# EAGLE design Adafruit Ultimate GPS Hat (EAGLE 9.1.3)
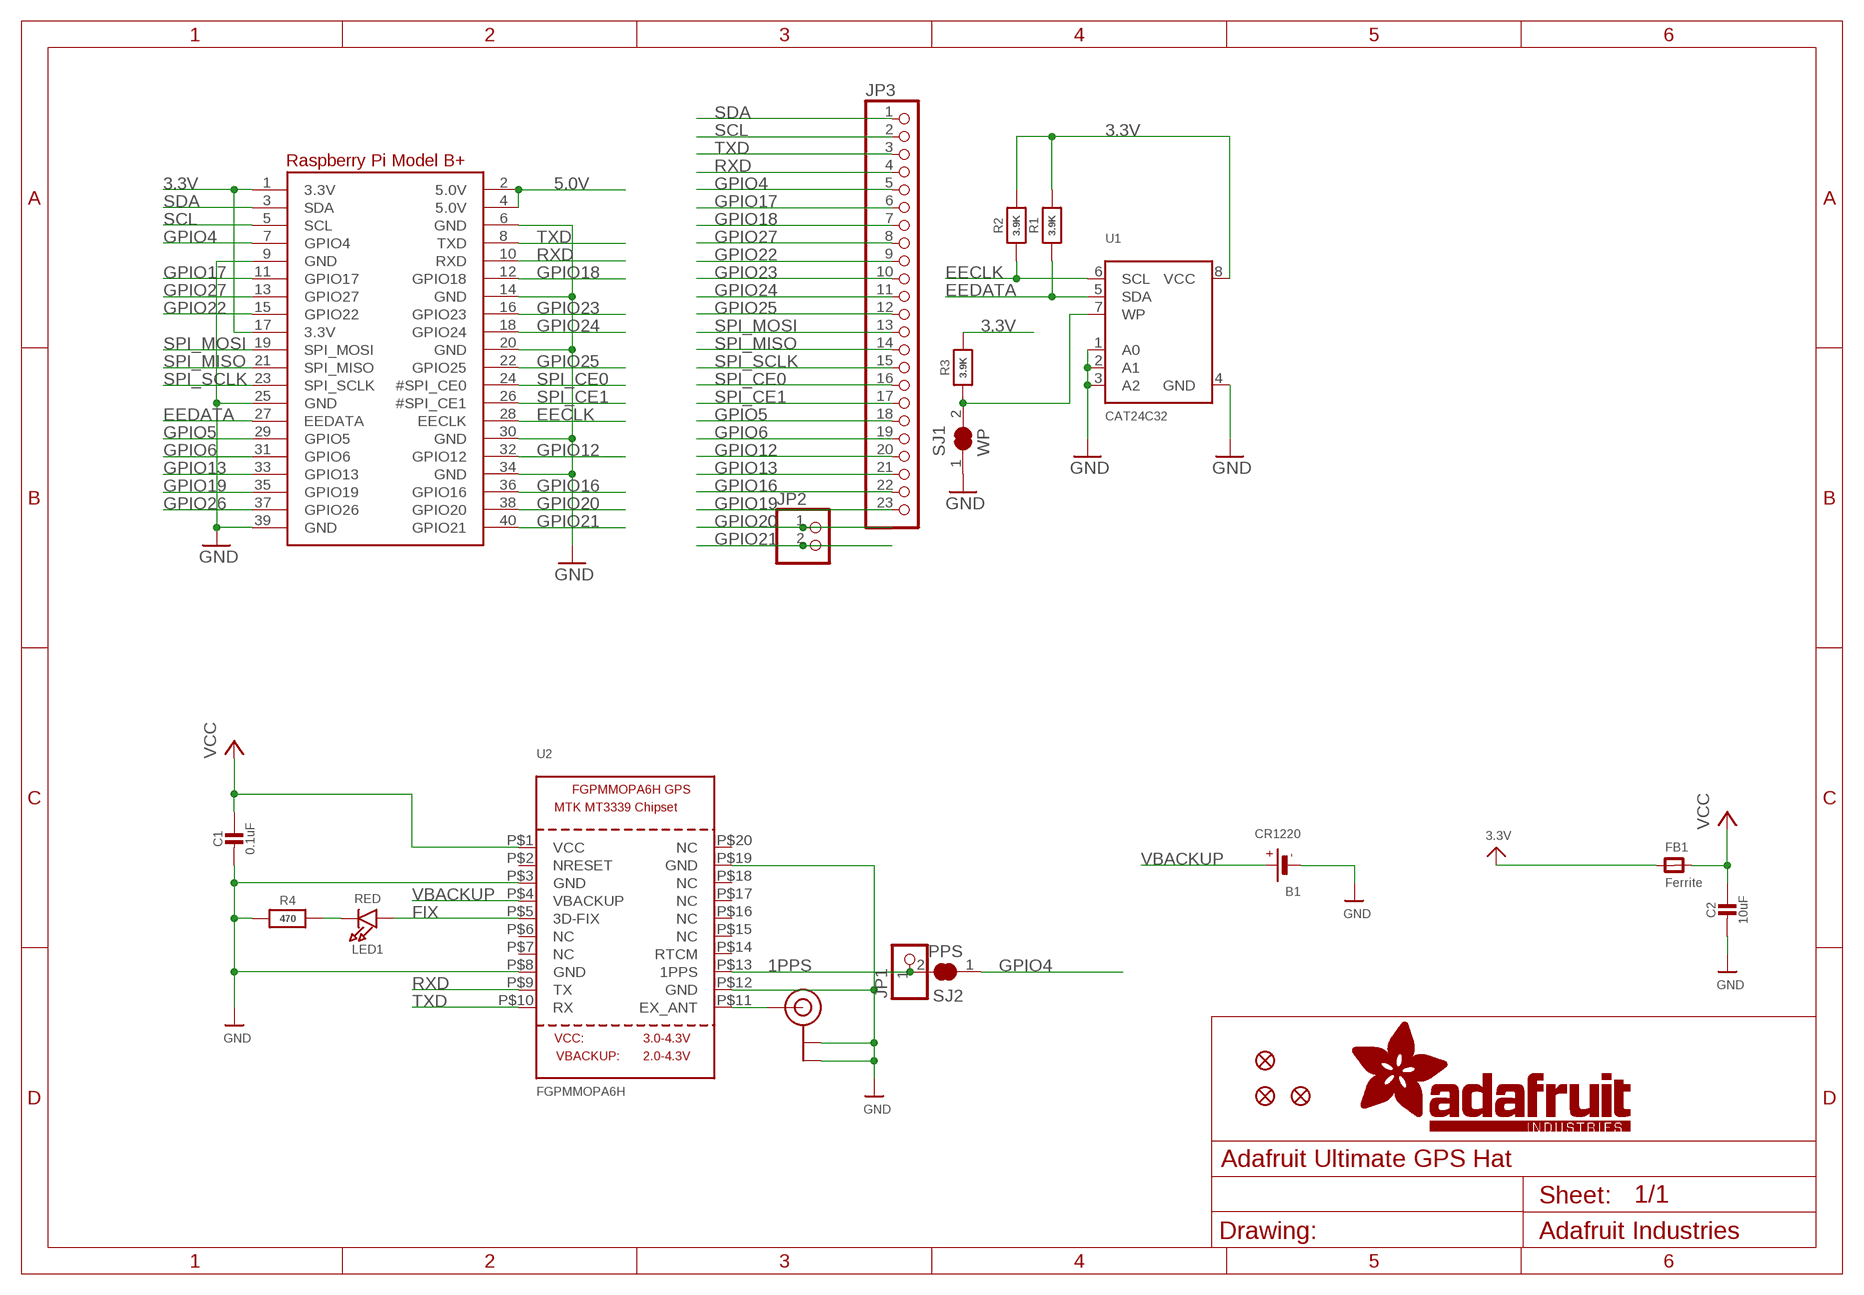
[diagram p0: schematic, sheet 1]

## Parts
B1  CR1220  BATTERYCR1220_SMT  [CR1220]
C1  0.1uF  CAP_CERAMIC0805-NOOUTLINE  [0805-NO]
C2  10uF  CAP_CERAMIC0805-NOOUTLINE  [0805-NO]
FB1  Ferrite  FERRITE0805  [0805]
FID1  FIDUCIAL_1MM  [FIDUCIAL_1MM]
FID2  FIDUCIAL_1MM  [FIDUCIAL_1MM]
FID3  FIDUCIAL_1MM  [FIDUCIAL_1MM]
JP1  PINHD-1X1CB  [1X01-CLEANBIG]
JP2  HEADER-1X2ROUND  [1X02_ROUND]
JP3  HEADER-1X23  [1X23_ROUND_70MIL]
LED1  RED  LED0805  [CHIPLED_0805]
R1  3.9K  RESISTOR0805_NOOUTLINE  [0805-NO]
R2  3.9K  RESISTOR0805_NOOUTLINE  [0805-NO]
R3  3.9K  RESISTOR0805_NOOUTLINE  [0805-NO]
R4  470  RESISTOR0805_NOOUTLINE  [0805-NO]
RPI1  RASPBERRYPI_BPLUS_HATSLOTS  [PI_HAT_SLOTS]
SJ1  WP  SOLDERJUMPER_CLOSED  [SOLDERJUMPER_CLOSEDWIRE]
SJ2  PPS  SOLDERJUMPER_CLOSED  [SOLDERJUMPER_CLOSEDWIRE]
U1  CAT24C32  EEPROM_I2C_SOIC8_GENERIC  [SOIC8_150MIL]
U2  FGPMMOPA6H  GPS_FGPMMOPA6H  [FGPMMOPA6H]
U$20  U.FL  [U.FL]

## Nets
1PPS: JP1.1 SJ2.2 U2.P$13(1PPS)
3.3V: FB1.1 R1.2 R2.2 R3.2 RPI1.1(3.3V) RPI1.17(3.3V) U1.8(VCC)
5.0V: RPI1.2(5.0V) RPI1.4(5.0V)
EECLK: R2.1 RPI1.28(EECLK) U1.6(SCL)
EEDATA: R1.1 RPI1.27(EEDATA) U1.5(SDA)
FIX: LED1.A U2.P$5(3D-FIX)
GND: B1.- C1.2 C2.2 R4.1 RPI1.6(GND) RPI1.9(GND) RPI1.14(GND) RPI1.20(GND) RPI1.25(GND) RPI1.30(GND) RPI1.34(GND) RPI1.39(GND) SJ1.1 U1.1(A0) U1.2(A1) U1.3(A2) U1.4(GND) U2.P$3(GND) U2.P$8(GND) U2.P$12(GND) U2.P$19(GND) U$20.P$1(GND) U$20.P$2(GND)
GPIO4: JP3.5 RPI1.7(GPIO4) SJ2.1
GPIO5: JP3.18 RPI1.29(GPIO5)
GPIO6: JP3.19 RPI1.31(GPIO6)
GPIO12: JP3.20 RPI1.32(GPIO12)
GPIO13: JP3.21 RPI1.33(GPIO13)
GPIO16: JP3.22 RPI1.36(GPIO16)
GPIO17: JP3.6 RPI1.11(GPIO17)
GPIO18: JP3.7 RPI1.12(GPIO18)
GPIO19: JP3.23 RPI1.35(GPIO19)
GPIO20: JP2.1 RPI1.38(GPIO20)
GPIO21: JP2.2 RPI1.40(GPIO21)
GPIO22: JP3.9 RPI1.15(GPIO22)
GPIO23: JP3.10 RPI1.16(GPIO23)
GPIO24: JP3.11 RPI1.18(GPIO24)
GPIO25: JP3.12 RPI1.22(GPIO25)
GPIO26: RPI1.37(GPIO26)
GPIO27: JP3.8 RPI1.13(GPIO27)
N$16: R3.1 SJ1.2 U1.7(WP)
N$24: LED1.C R4.2
N$26: U2.P$11(EX_ANT) U$20.P$3(SIGNAL)
RXD: JP3.4 RPI1.10(RXD) U2.P$9(TX)
SCL: JP3.2 RPI1.5(SCL)
SDA: JP3.1 RPI1.3(SDA)
SPI_CE0: JP3.16 RPI1.24(#SPI_CE0)
SPI_CE1: JP3.17 RPI1.26(#SPI_CE1)
SPI_MISO: JP3.14 RPI1.21(SPI_MISO)
SPI_MOSI: JP3.13 RPI1.19(SPI_MOSI)
SPI_SCLK: JP3.15 RPI1.23(SPI_SCLK)
TXD: JP3.3 RPI1.8(TXD) U2.P$10(RX)
VBACKUP: B1.+$1(+) B1.+$2(+) U2.P$4(VBACKUP)
VCC: C1.1 C2.1 FB1.2 U2.P$1(VCC)
Unconnected: U2.P$2(NRESET) U2.P$6(NC) U2.P$7(NC) U2.P$14(RTCM) U2.P$15(NC) U2.P$16(NC) U2.P$17(NC) U2.P$18(NC) U2.P$20(NC)

## Library data of the parts
B1 = microbuilder:BATTERY: CR1220 SMT - Digikey: 3001K-ND CD2032 BAT-HLD-001 - Digikey: BAT-HLD-001-ND
C1 C2 = microbuilder:CAP_CERAMIC: Ceramic Capacitors For new designs, use the packages preceded by an '_' character since they are more reliable: The following footprints should be used on most boards: _0402 - Standard footprint for regular board layouts _0603 - Standard footprint for regular board layouts _0805 - Standard footprint for regular board layouts _1206 - Standard footprint for regular board layouts For extremely tight-pitch boards where space is at a premium, the following 'micro-pitch' footprints can be used (smaller pads, no silkscreen outline, etc.): _0402MP - Micro-pitch footprint for very dense/compact boards _0603MP - Micro-pitch footprint for very dense/compact boards _0805MP - Micro-pitch footprint for very dense/compact boards _1206MP - Micro-pitch footprint for very dense/compact boards
FB1 = microbuilder:FERRITE: Ferrite Bead 0603 MMZ1608B121C - 120 Ohm @ 100MHz, 600mA, 0.15 Ohm DC Resistance - Digikey: 445-2164-1-ND BK1608HW121-T - 120 Ohm, 600mA Ferrite Chip - Digikey: 587-1876-2-ND 0805 HZ0805B272R-10 - 2.7K Ohm @ 100MHz, 200mA, 0.8 Ohm DC Resistance - Digikey: 240-2504-1-ND (see also Murata BLM21BD272SN1L) MMZ2012Y152B - 1.5K Ohm @ 100MHz, 500mA, 0.4 Ohm DC Resistance - Digikey: 445-1560-1-ND - Mainly for high frequency (80-400MHz) MMZ2012R102A - 1K Ohm @ 100MHz, 500mA, 0.3 Ohm DC Resistance - Digikey: 445-1555-2-ND - More general purpose (10-200MHz)
FID1-FID3 = microbuilder:FIDUCIAL: Fiducial Alignment Points Various fiducial points for machine vision alignment.; BOM: EXCLUDE
JP1 = adafruit:PINHD-1X1: Pin header 1x1 for 0.1" spacing With round pins
JP2 = microbuilder:HEADER-1X2: PIN HEADER
JP3 = microbuilder:HEADER-1X23
LED1 = microbuilder:LED: LED 0603 - 0603 Surface Mount Package 2mA: Green LED - Low Power (3.9mcd, 2ma, 1.7Vf) - Digikey: 475-2709-2-ND Orange LED - Low Power (9.8mcd, 2ma, 1.8Vf) - Digikey: 475-1194-2-ND Red LED - Low Power (5mcd, 2ma, 1.8Vf) - Digikey: 475-1195-2-ND Yellow LED - Low Power (7mcd, 2ma, 1.8Vf) - Digikey: 475-1196-2-ND 5mA: Blue LED - Low Power (17mcd, 5ma, 2.9Vf) - Digikey: LNJ937W8CRACT-ND 0805 - 0805 Surface Mount Package 2mA: Red LED (8.8mcd, 2mA, 1.8Vf, Clear) - Low Power [Digikey: 475-2510-1-ND] Green LED (5mcd, 2mA, 1.8Vf, Clear) - Low Power [Digikey: 475-2730-1-ND] Yellow LED (11.3mcd, 2mA, 1.8Vf, Clear) - Low Power [Digikey: 475-2555-1-ND] 20mA: Red LED (104mcd, 20mA, Diffused) - LS R976 [Digikey: 475-1278-6-ND] Red LED (12mcd, 20mA, 2.0Vf, Clear) - APT2012EC [Digikey: 754-1128-1-ND] Green LED (15mcd, 20mA, 2.2Vf, Clear) - APT2012GC [Digikey: 754-1131-1-ND] Orange LED (160mcd, 20mA, 2.1Vf, Clear) - APT2012SECK [Digikey: 754-1130-1-ND] 1206 - 1206 Surface Mount Package Green LED (26mcd, 20mA, Diffused) - LG N971 [Digikey: 475-1407-6-ND] Red LED (15mcd, 20mA, Diffused) - LH N974 [Digikey: 475-1416-6-ND] Cree - Cree High-Power Surface Mount LEDs XPEBWT-L1-0000-00D50 - White 111lm 350mA 2.9Vf 6200K 110° XTEAWT-00-0000-00000LEE3 - White 114lm 350mA 2.85Vf 5000K 115° Everlight - Everlight 45-21 Series Surface Mount LEDs 45-21/QK2C-B2832AC2CB2/2T - Warm White 2000mcd 20mA 3.25Vf 3050K 120° 45-21/LK2C-B38452C4CB2/2T - Nuetral White 2000mcd 20mA 3.25Vf 4150K 120° 45-21/LK2C-B50634C6CB2/2T - Cold White 2200mcd 20mA 3.25Vf 5650K 120° PLCC2 Reverse Mount LS T77K-J1L2-1-0-2-R18-Z - Red 11.25mcd 2mA 1.8Vf 630nm 120° LO T77K-L1M2-24-Z - Orange 19.6mcd 2mA 1.8Vf 606nm 120° LY T77K-K2M1-26-Z - Yellow 15.7mcd 2mA 1.8Vf 587nm 120°
R1-R4 = microbuilder:RESISTOR: Resistors For new designs, use the packages preceded by an '_' character since they are more reliable: The following footprints should be used on most boards: _0402 - Standard footprint for regular board layouts _0603 - Standard footprint for regular board layouts _0805 - Standard footprint for regular board layouts _1206 - Standard footprint for regular board layouts For extremely tight-pitch boards where space is at a premium, the following 'micro-pitch' footprints can be used (smaller pads, no silkscreen outline, etc.): _0402MP - Micro-pitch footprint for very dense/compact boards _0603MP - Micro-pitch footprint for very dense/compact boards _0805MP - Micro-pitch footprint for very dense/compact boards _1206MP - Micro-pitch footprint for very dense/compact boards
RPI1 = microbuilder:RASPBERRYPI_BPLUS
SJ1 SJ2 = microbuilder:SOLDERJUMPER_CLOSED: Solder Jumper - Closed These solder jumpers are closed by default CLOSEDWIRE - 10 mil trace between pads that can be cut and resoldered later CLOSEDPERM - 63 mil trace between pads for a permanent connection (used to 'bridge' two signals, a shameless hack for Eagle). Can double as a test point as well (no cream layer)
U1 = microbuilder:EEPROM_I2C_SOIC8_GENERIC: Note: The same pinout is used for many I2C EEPROMs in SOIC8(150mil) from a variety of manufacturers and in various sizes. Examples: 16K (2K x 8 Bit) I2C EEPROM 1.7-5.5V, 400KHz, -40°C-85°C Digikey: CAT24C16WI-GT3CT-ND 256K (32K x 8 Bit) I2C EEPROM 1.7-5.5V, 400KHz, -40°C-85°C Digikey: 24AA256-I/SN-ND
U2 = microbuilder:GPS_FGPMMOPA6H: GPS Module - MTK MT3339 Chipset, -165dBm sensitivity, 22 channels, 10Hz, auto-select external antenna options
U$20 = microbuilder:U.FL: U.FL Antenna Connector

## Board
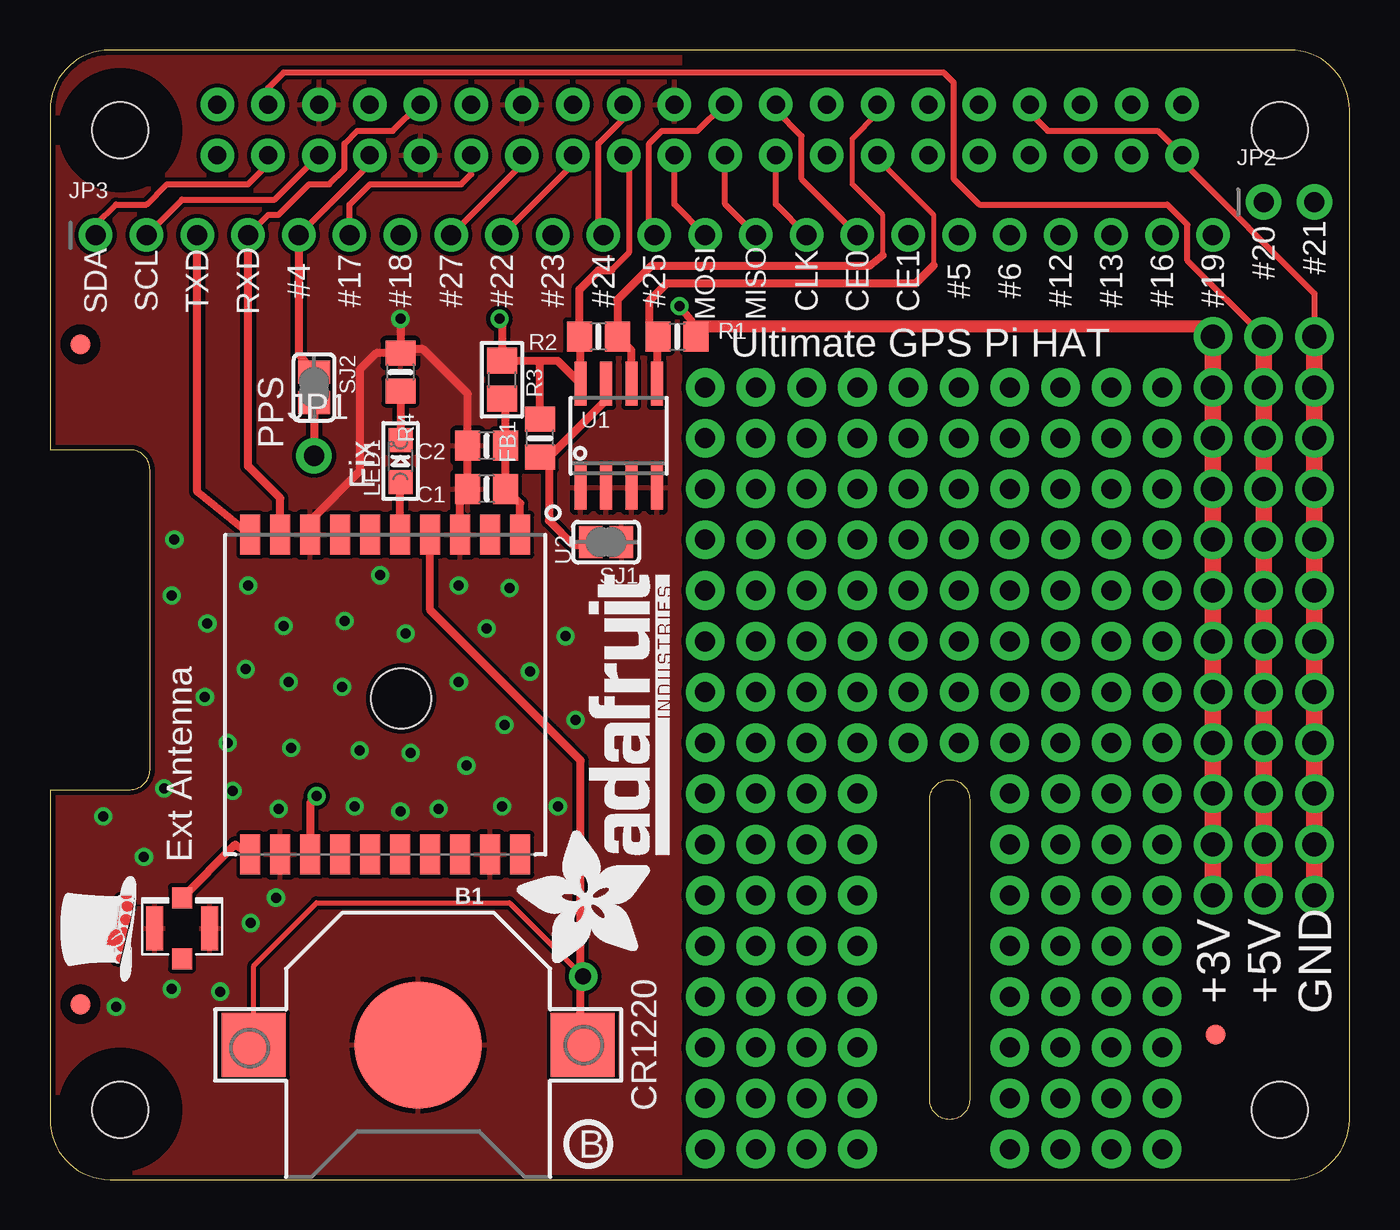
[diagram p1: board, top side]
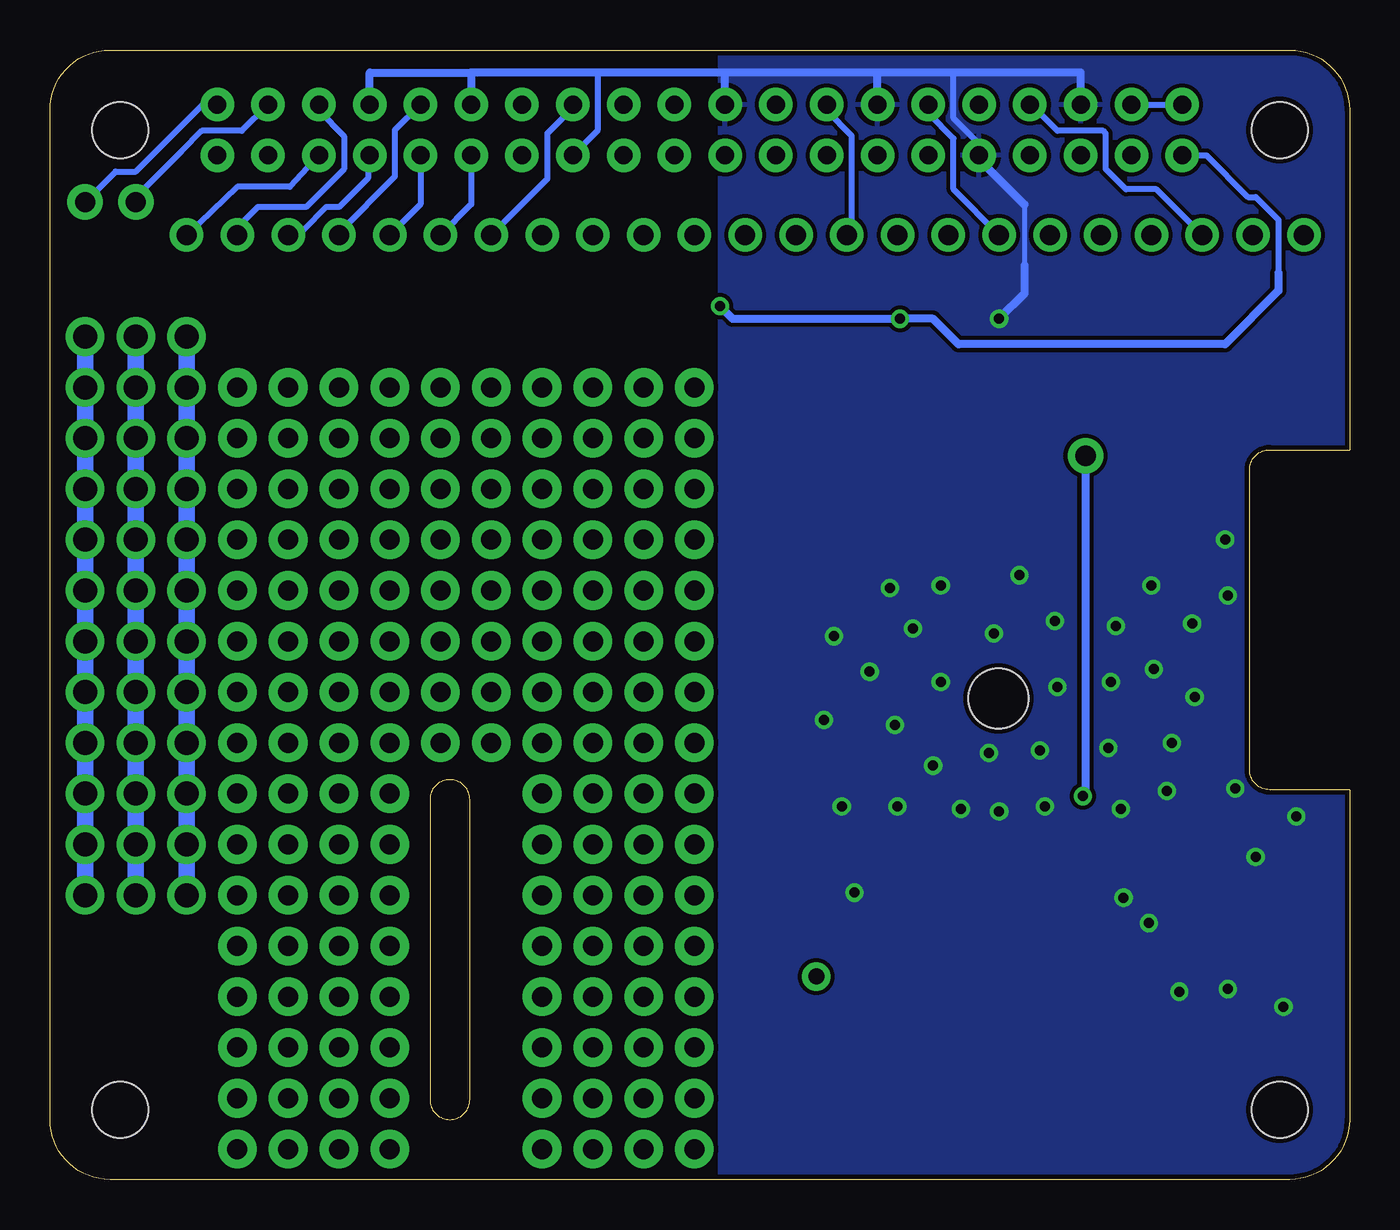
[diagram p2: board, bottom side, seen from below]

Size 65 x 56.5 mm. Coordinates in mm from the lower left corner, seen from the top.
Copper layers (1*16): Top 0.035mm / dielectric 1.5mm / Bottom 0.035mm
Design rules "adafruit": minimum track width 8mil, minimum drill 15.5mil, track to track 8mil, track to pad 8mil, pad to pad 8mil, via to via 8mil, smd to smd 8mil, copper to edge 10mil, drill to drill 8mil, minimum pad ring 10mil, minimum via ring 8mil, stop-mask expansion 2mil, vias tented up to drill 20mil, thermal gap 10mil

### Footprints (pad centres in the part's own frame; a part is rotated, then mirrored left to right if it is on the bottom)
CR1220 = smd 3.2 x 3.2: +$1 -8.225,0; +$2 8.225,0 | smd 6.35 x 6.35: - 0,0
0805-NO = smd 1.24 x 1.5: 1 -0.95,0; 2 0.95,0
0805 = smd 1.3 x 1.5: 1 -0.95,0; 2 0.95,0
FIDUCIAL_1MM = smd 1 x 1: 1 0,0
1X01-CLEANBIG = drill 1.016 pad 1.778: 1 0,0
1X02_ROUND = drill 1 pad 1.778: 1 -1.27,0; 2 1.27,0
1X23_ROUND_70MIL = drill 1 pad 1.676: 1 -27.94,0; 2 -25.4,0; 3 -22.86,0; 4 -20.32,0; 5 -17.78,0; 6 -15.24,0; 7 -12.7,0; 8 -10.16,0; 9 -7.62,0; 10 -5.08,0; 11 -2.54,0; 12 0,0; 13 2.54,0; 14 5.08,0; 15 7.62,0; 16 10.16,0; 17 12.7,0; 18 15.24,0; 19 17.78,0; 20 20.32,0; 21 22.86,0; 22 25.4,0; 23 27.94,0
CHIPLED_0805 = smd 1.2 x 1.2: A 0,-1.05; C 0,1.05
PI_HAT_SLOTS = drill 0.9 pad 1.676: 1 8.37,51.23; 2 8.37,53.77; 3 10.91,51.23; 4 10.91,53.77; 5 13.45,51.23; 6 13.45,53.77; 7 15.99,51.23; 8 15.99,53.77; 9 18.53,51.23; 10 18.53,53.77; 11 21.07,51.23; 12 21.07,53.77; 13 23.61,51.23; 14 23.61,53.77; 15 26.15,51.23; 16 26.15,53.77; 17 28.69,51.23; 18 28.69,53.77; 19 31.23,51.23; 20 31.23,53.77; 21 33.77,51.23; 22 33.77,53.77; 23 36.31,51.23; 24 36.31,53.77; 25 38.85,51.23; 26 38.85,53.77; 27 41.39,51.23; 28 41.39,53.77; 29 43.93,51.23; 30 43.93,53.77; 31 46.47,51.23; 32 46.47,53.77; 33 49.01,51.23; 34 49.01,53.77; 35 51.55,51.23; 36 51.55,53.77; 37 54.09,51.23; 38 54.09,53.77; 39 56.63,51.23; 40 56.63,53.77 | hole 2.8: 3.5,3.5; 3.5,52.5; 61.5,52.5; 61.5,3.5
SOLDERJUMPER_CLOSEDWIRE = smd 1.168 x 1.6: 1 -0.762,0; 2 0.762,0 | smd 0.635 x 0.203: WIRE 0,0
SOIC8_150MIL = smd 0.6 x 2.2: 1 -1.905,-2.6; 2 -0.635,-2.6; 3 0.635,-2.6; 4 1.905,-2.6; 5 1.905,2.6; 6 0.635,2.6; 7 -0.635,2.6; 8 -1.905,2.6
FGPMMOPA6H = smd 2 x 1: P$1 -8,6.75; P$2 -8,5.25; P$3 -8,3.75; P$4 -8,2.25; P$5 -8,0.75; P$6 -8,-0.75; P$7 -8,-2.25; P$8 -8,-3.75; P$9 -8,-5.25; P$10 -8,-6.75; P$11 8,-6.75; P$12 8,-5.25; P$13 8,-3.75; P$14 8,-2.25; P$15 8,-0.75; P$16 8,0.75; P$17 8,2.25; P$18 8,3.75; P$19 8,5.25; P$20 8,6.75 | hole 3: 0.2,0.8
U.FL = smd 2.2 x 0.85: P$1 0,1.375; P$2 0,-1.375 | smd 1.05 x 1: P$3 1.525,0; P$4 -1.525,0

### Placement (x,y rotation side)
B1  18.41,6.73 180 top
C1  21.84,34.54 180 top
C2  21.84,36.7 180 top
FB1  22.61,40.01 270 top
FID1  1.52,8.76 0 top
FID2  1.52,41.78 0 top
FID3  58.29,7.24 0 top
JP1  13.21,36.2 0 top
JP2  61.98,48.9 0 top
JP3  30.23,47.24 0 top
LED1  17.53,35.94 0 top
R1  31.37,42.16 0 top
R2  27.43,42.16 180 top
R3  24.51,37.08 90 top
R4  17.53,40.39 270 top
RPI1  0,0 0 top
SJ1  27.81,31.88 180 top
SJ2  13.21,39.62 270 top
U1  28.45,37.21 0 top
U2  16.76,24.26 270 top
U$3  [ADAFRUIT_TEXT_20MM]  30.99,10.67 90 top
U$4  [PIHATLOGO]  4.32,9.91 90 top
U$6  [PCBFEAT-REV-056]  26.92,1.78 0 top
U$20  6.6,12.57 90 top

### Tracks (layer width: path | path; a pad name or v marks a point on that pad's centre or on a via)
1PPS  (via drill 0.5)
  Top 0.406: SJ2.2 JP1.1 | v13.34,19.18 13.01,18.86 U2.P$13
  Bottom 0.406: JP1.1 13.21,19.3 v13.34,19.18
3.3V  (via drill 0.5, 1.2 pad 1.93)
  Top 0.305: RPI1.17 28.96,50.96 28.96,46.36 28.07,45.47
  Top 0.406: 24.64,40.95 FB1.1 22.61,42.93 v22.48,43.05 | 24.64,40.95 25.4,40.95 U1.8 26.54,42.23 R2.2 26.48,44.52 27.43,45.47 28.07,45.47 | R1.2 32.07,42.99 v31.5,43.69 | R3.2 24.51,40.83 24.64,40.95
  Top 0.61: v58.17,42.16 57.66,42.67 32,42.67 32.07,42.61 R1.2
  Top 0.813: v58.17,42.16 v58.17,14.22
  Bottom 0.305: RPI1.1 7.16,51.23 5.08,49.15 4.7,49.15 3.56,48.01 3.56,45.34
  Bottom 0.406: 3.56,45.34 3.56,44.45 6.22,41.78 19.56,41.78 20.83,43.05 v22.48,43.05 30.86,43.05 v31.5,43.69
  Bottom 0.813: v58.17,14.22 v58.17,16.76 v58.17,19.3 v58.17,21.84 v58.17,24.38 v58.17,26.92 v58.17,29.46 v58.17,32 v58.17,34.54 v58.17,37.08 v58.17,39.62 v58.17,42.16
5.0V  (via drill 1.2 pad 1.93)
  Top 0.305: RPI1.4 10.91,54.6 11.68,55.37 44.7,55.37 45.21,54.86 45.21,50.04 46.48,48.77 55.88,48.77 56.9,47.75 56.9,45.97 v60.71,42.16
  Top 0.813: v60.71,42.16 60.71,13.97
  Bottom 0.305: RPI1.4 RPI1.2
  Bottom 0.813: v60.71,14.22 v60.71,16.76 v60.71,19.3 v60.71,21.84 v60.71,24.38 v60.71,26.92 v60.71,29.46 v60.71,32 v60.71,34.54 v60.71,37.08 v60.71,39.62 v60.71,42.16
EECLK
  Top 0.254: 41.66,46.23 41.66,48.26 40.13,49.78 40.13,52.07 41.39,53.33 RPI1.28
  Top 0.406: 41.66,46.23 41.02,45.72 30.1,45.72 28.38,44 R2.1 29.08,41.46 U1.6
EEDATA
  Top 0.254: RPI1.27 41.39,51.07 44.2,48.26 44.2,45.72
  Top 0.406: 44.2,45.72 43.31,44.83 30.86,44.83 29.97,43.94 29.97,42.16 30.35,42.16 | 30.35,42.16 U1.5 | R1.1 30.35,42.16
FIX
  Top 0.406: U2.P$5 17.51,34.88 LED1.A
GND  (via drill 0.5, 1.2 pad 1.93)
  Top 0.305: RPI1.34 49.01,53.35 49.91,52.45 55.41,52.45 RPI1.39 56.63,50.94 63.25,44.32 v63.25,42.16
  Top 0.406: U2.P$3 20.51,34.54 C1.2 C2.2 20.89,39.3 18.67,41.53 17.72,41.53 R4.1 | v17.53,43.05 R4.1 | R4.1 16.32,41.34 15.49,40.51 15.49,35.43 13.08,33.02 13.08,31.82 U2.P$8
  Top 0.813: v63.25,42.16 v63.25,14.22
  Bottom 0.254: 16.26,48.77 16.26,45.72
  Bottom 0.305: 19.94,55.37 19.81,55.25 19.81,53.09 18.53,51.8 RPI1.9 18.53,51.04 | RPI1.25 37.59,52.49 37.59,55.37
  Bottom 0.406: RPI1.34 49.01,55.37 43.94,55.37 | 43.94,55.37 43.94,53.77 RPI1.30 | RPI1.20 31.23,55.37 | 31.23,55.37 37.59,55.37 43.94,55.37 | RPI1.14 23.61,55.37 | 23.61,55.37 31.23,55.37 | RPI1.6 13.45,55.37 19.94,55.37 23.61,55.37 | 18.53,51.04 16.26,48.77 | 16.26,45.72 16.26,44.32 v17.53,43.05
  Bottom 0.813: v63.25,14.22 v63.25,16.76 v63.25,19.3 v63.25,21.84 v63.25,24.38 v63.25,26.92 v63.25,29.46 v63.25,32 v63.25,34.54 v63.25,37.08 v63.25,39.62 v63.25,42.16
  other vias: 11.43,18.54 9.14,19.43 8.89,21.84 12.07,21.59 11.94,24.89 11.68,27.69 9.78,25.53 9.91,29.72 6.22,32 6.1,29.21 5.71,19.56 7.75,24.13 7.87,27.81 2.67,18.16 4.7,16.13 6.1,9.53 3.3,8.64 8.51,9.4 10.03,12.83 15.24,18.67 15.49,21.46 14.61,24.64 14.73,27.94 16.51,30.23 17.78,27.3 20.45,29.72 22.99,29.59 21.84,27.56 24,25.4 26.29,22.99 25.4,18.67 22.61,18.67 22.73,22.73 20.45,24.89 20.83,20.7 19.43,18.54 18.03,21.34 17.53,18.41 25.78,27.18 11.3,14.1 24.76,14.35
  pour Top: -0.25,56.52 31.5,56.52 31.5,0 -0.25,0
  pour Bottom: -0.25,56.52 31.5,56.52 31.5,0 -0.25,0
GPIO4
  Top 0.305: JP3.5 15.99,50.79 RPI1.7
  Top 0.406: JP3.5 12.45,41.27 SJ2.1
GPIO5
  Bottom 0.305: RPI1.29 43.93,48.78 JP3.18
GPIO6
  Bottom 0.305: RPI1.31 46.47,48.78 JP3.19
GPIO12
  Bottom 0.305: RPI1.32 47.75,52.49 47.75,50.16 50.55,47.37 JP3.20
GPIO13
  Bottom 0.305: RPI1.33 49.1,51.23 49.1,50.09 50.55,48.64 51.18,48.64 52.32,47.5 52.83,47.5 JP3.21
GPIO16
  Bottom 0.305: RPI1.36 51.55,53.45 50.29,52.2 50.29,50.55 52.2,48.64 54.61,48.64 55.63,47.62 JP3.22
GPIO17
  Top 0.305: JP3.6 14.99,48.77 16,49.78 20.57,49.78 21.07,50.28 RPI1.11
GPIO18
  Bottom 0.305: JP3.7 19.81,49.53 19.81,52.07 21.07,53.33 RPI1.12
GPIO19
  Bottom 0.305: RPI1.35 53,49.66 55.63,49.66 JP3.23
GPIO20
  Bottom 0.305: RPI1.38 55.41,52.45 57.4,52.45 58.42,51.44 60.71,49.15 JP2.1
GPIO21
  Bottom 0.305: RPI1.40 56.68,53.72 57.4,53.72 60.71,50.42 61.72,50.42 JP2.2
GPIO22
  Top 0.305: JP3.9 26.15,50.79 RPI1.15
GPIO23
  Bottom 0.305: JP3.10 24.89,47.5 24.89,52.2 26.15,53.45 RPI1.16
GPIO24
  Top 0.305: JP3.11 27.43,47.5 27.43,51.82 28.69,53.07 RPI1.18
GPIO25
  Top 0.305: JP3.12 29.97,47.5 29.97,51.82 30.61,52.45 32.39,52.45 33.7,53.77 RPI1.22
GPIO27
  Top 0.305: JP3.8 23.61,50.79 RPI1.13
N$1  (via drill 1 pad 1.93)
  other vias: 55.63,39.62
N$2  (via drill 1 pad 1.93)
  other vias: 55.63,37.08
N$3  (via drill 1 pad 1.93)
  other vias: 55.63,34.54
N$4  (via drill 1 pad 1.93)
  other vias: 53.09,34.54
N$5  (via drill 1 pad 1.93)
  other vias: 53.09,37.08
N$6  (via drill 1 pad 1.93)
  other vias: 53.09,39.62
N$7  (via drill 1 pad 1.93)
  other vias: 48.01,39.62
N$8  (via drill 1 pad 1.93)
  other vias: 50.55,34.54
N$9  (via drill 1 pad 1.93)
  other vias: 48.01,37.08
N$10  (via drill 1 pad 1.93)
  other vias: 48.01,34.54
N$11  (via drill 1 pad 1.93)
  other vias: 50.55,37.08
N$12  (via drill 1 pad 1.93)
  other vias: 50.55,39.62
N$13  (via drill 1 pad 1.93)
  other vias: 45.47,39.62
N$14  (via drill 1 pad 1.93)
  other vias: 45.47,37.08
N$15  (via drill 1 pad 1.93)
  other vias: 45.47,34.54
N$16
  Top 0.406: R3.1 24.96,36.13 | 24.96,36.13 27.81,38.99 U1.7 | 24.96,36.13 24.96,32.95 26.16,31.75 26.92,31.75 SJ1.2
N$17  (via drill 1 pad 1.93)
  other vias: 42.93,34.54
N$18  (via drill 1 pad 1.93)
  other vias: 42.93,37.08
N$19  (via drill 1 pad 1.93)
  other vias: 42.93,39.62
N$20  (via drill 1 pad 1.93)
  other vias: 40.39,39.62
N$21  (via drill 1 pad 1.93)
  other vias: 40.39,37.08
N$22  (via drill 1 pad 1.93)
  other vias: 40.39,34.54
N$23  (via drill 1 pad 1.93)
  other vias: 37.85,34.54
N$24
  Top 0.406: R4.2 LED1.C
N$25  (via drill 1 pad 1.93)
  other vias: 37.85,37.08
N$26
  Top 0.406: U$20.P$3 9.26,16.76 U2.P$11
N$27  (via drill 1 pad 1.93)
  other vias: 37.85,39.62
N$28  (via drill 1 pad 1.93)
  other vias: 35.31,39.62
N$29  (via drill 1 pad 1.93)
  other vias: 35.31,34.54
N$30  (via drill 1 pad 1.93)
  other vias: 35.31,37.08
N$31  (via drill 1 pad 1.93)
  other vias: 32.77,39.62
N$32  (via drill 1 pad 1.93)
  other vias: 32.77,37.08
N$33  (via drill 1 pad 1.93)
  other vias: 32.77,34.54
N$34  (via drill 1 pad 1.93)
  other vias: 32.77,32
N$35  (via drill 1 pad 1.93)
  other vias: 35.31,32
N$36  (via drill 1 pad 1.93)
  other vias: 37.85,32
N$37  (via drill 1 pad 1.93)
  other vias: 40.39,32
N$38  (via drill 1 pad 1.93)
  other vias: 45.47,32
N$39  (via drill 1 pad 1.93)
  other vias: 42.93,32
N$40  (via drill 1 pad 1.93)
  other vias: 50.55,32
N$41  (via drill 1 pad 1.93)
  other vias: 53.09,32
N$42  (via drill 1 pad 1.93)
  other vias: 55.63,32
N$43  (via drill 1 pad 1.93)
  other vias: 48.01,32
N$44  (via drill 1 pad 1.93)
  other vias: 32.77,29.46
N$45  (via drill 1 pad 1.93)
  other vias: 32.77,26.92
N$46  (via drill 1 pad 1.93)
  other vias: 32.77,24.38
N$47  (via drill 1 pad 1.93)
  other vias: 32.77,21.84
N$48  (via drill 1 pad 1.93)
  other vias: 32.77,16.76
N$49  (via drill 1 pad 1.93)
  other vias: 32.77,19.3
N$50  (via drill 1 pad 1.93)
  other vias: 32.77,14.22
N$51  (via drill 1 pad 1.93)
  other vias: 32.77,11.68
N$52  (via drill 1 pad 1.93)
  other vias: 32.77,9.14
N$53  (via drill 1 pad 1.93)
  other vias: 32.77,6.6
N$54  (via drill 1 pad 1.93)
  other vias: 32.77,4.06
N$55  (via drill 1 pad 1.93)
  other vias: 32.77,1.52
N$56  (via drill 1 pad 1.93)
  other vias: 35.31,1.52
N$57  (via drill 1 pad 1.93)
  other vias: 35.31,4.06
N$58  (via drill 1 pad 1.93)
  other vias: 37.85,6.6
N$59  (via drill 1 pad 1.93)
  other vias: 35.31,6.6
N$60  (via drill 1 pad 1.93)
  other vias: 35.31,9.14
N$61  (via drill 1 pad 1.93)
  other vias: 35.31,11.68
N$62  (via drill 1 pad 1.93)
  other vias: 35.31,14.22
N$63  (via drill 1 pad 1.93)
  other vias: 35.31,16.76
N$64  (via drill 1 pad 1.93)
  other vias: 35.31,19.3
N$65  (via drill 1 pad 1.93)
  other vias: 35.31,21.84
N$66  (via drill 1 pad 1.93)
  other vias: 35.31,24.38
N$67  (via drill 1 pad 1.93)
  other vias: 35.31,26.92
N$68  (via drill 1 pad 1.93)
  other vias: 35.31,29.46
N$69  (via drill 1 pad 1.93)
  other vias: 37.85,29.46
N$70  (via drill 1 pad 1.93)
  other vias: 37.85,24.38
N$71  (via drill 1 pad 1.93)
  other vias: 37.85,26.92
N$72  (via drill 1 pad 1.93)
  other vias: 37.85,21.84
N$73  (via drill 1 pad 1.93)
  other vias: 37.85,19.3
N$74  (via drill 1 pad 1.93)
  other vias: 37.85,16.76
N$75  (via drill 1 pad 1.93)
  other vias: 37.85,14.22
N$76  (via drill 1 pad 1.93)
  other vias: 37.85,11.68
N$77  (via drill 1 pad 1.93)
  other vias: 37.85,9.14
N$78  (via drill 1 pad 1.93)
  other vias: 37.85,4.06
N$79  (via drill 1 pad 1.93)
  other vias: 37.85,1.52
N$80  (via drill 1 pad 1.93)
  other vias: 40.39,1.52
N$81  (via drill 1 pad 1.93)
  other vias: 40.39,4.06
N$82  (via drill 1 pad 1.93)
  other vias: 40.39,6.6
N$83  (via drill 1 pad 1.93)
  other vias: 40.39,9.14
N$84  (via drill 1 pad 1.93)
  other vias: 40.39,11.68
N$85  (via drill 1 pad 1.93)
  other vias: 40.39,14.22
N$86  (via drill 1 pad 1.93)
  other vias: 40.39,16.76
N$87  (via drill 1 pad 1.93)
  other vias: 40.39,21.84
N$88  (via drill 1 pad 1.93)
  other vias: 40.39,24.38
N$89  (via drill 1 pad 1.93)
  other vias: 40.39,26.92
N$90  (via drill 1 pad 1.93)
  other vias: 40.39,29.46
N$91  (via drill 1 pad 1.93)
  other vias: 42.93,29.46
N$92  (via drill 1 pad 1.93)
  other vias: 42.93,26.92
N$93  (via drill 1 pad 1.93)
  other vias: 42.93,24.38
N$94  (via drill 1 pad 1.93)
  other vias: 42.93,21.84
N$95  (via drill 1 pad 1.93)
  other vias: 40.39,19.3
N$96  (via drill 1 pad 1.93)
  other vias: 48.01,1.52
N$97  (via drill 1 pad 1.93)
  other vias: 48.01,6.6
N$98  (via drill 1 pad 1.93)
  other vias: 48.01,4.06
N$99  (via drill 1 pad 1.93)
  other vias: 48.01,9.14
N$100  (via drill 1 pad 1.93)
  other vias: 48.01,11.68
N$101  (via drill 1 pad 1.93)
  other vias: 48.01,14.22
N$102  (via drill 1 pad 1.93)
  other vias: 48.01,19.3
N$103  (via drill 1 pad 1.93)
  other vias: 48.01,21.84
N$104  (via drill 1 pad 1.93)
  other vias: 48.01,24.38
N$105  (via drill 1 pad 1.93)
  other vias: 48.01,26.92
N$106  (via drill 1 pad 1.93)
  other vias: 48.01,29.46
N$107  (via drill 1 pad 1.93)
  other vias: 45.47,29.46
N$108  (via drill 1 pad 1.93)
  other vias: 45.47,26.92
N$109  (via drill 1 pad 1.93)
  other vias: 45.47,24.38
N$110  (via drill 1 pad 1.93)
  other vias: 45.47,21.84
N$111  (via drill 1 pad 1.93)
  other vias: 50.55,29.46
N$112  (via drill 1 pad 1.93)
  other vias: 53.09,29.46
N$113  (via drill 1 pad 1.93)
  other vias: 55.63,29.46
N$114  (via drill 1 pad 1.93)
  other vias: 55.63,26.92
N$115  (via drill 1 pad 1.93)
  other vias: 53.09,26.92
N$116  (via drill 1 pad 1.93)
  other vias: 50.55,26.92
N$117  (via drill 1 pad 1.93)
  other vias: 50.55,24.38
N$118  (via drill 1 pad 1.93)
  other vias: 55.63,24.38
N$119  (via drill 1 pad 1.93)
  other vias: 53.09,24.38
N$120  (via drill 1 pad 1.93)
  other vias: 53.09,21.84
N$121  (via drill 1 pad 1.93)
  other vias: 50.55,21.84
N$122  (via drill 1 pad 1.93)
  other vias: 50.55,19.3
N$123  (via drill 1 pad 1.93)
  other vias: 53.09,19.3
N$124  (via drill 1 pad 1.93)
  other vias: 55.63,19.3
N$125  (via drill 1 pad 1.93)
  other vias: 55.63,21.84
N$126  (via drill 1 pad 1.93)
  other vias: 55.63,16.76
N$127  (via drill 1 pad 1.93)
  other vias: 53.09,16.76
N$128  (via drill 1 pad 1.93)
  other vias: 50.55,16.76
N$129  (via drill 1 pad 1.93)
  other vias: 48.01,16.76
N$130  (via drill 1 pad 1.93)
  other vias: 50.55,14.22
N$131  (via drill 1 pad 1.93)
  other vias: 53.09,14.22
N$132  (via drill 1 pad 1.93)
  other vias: 55.63,14.22
N$133  (via drill 1 pad 1.93)
  other vias: 55.63,11.68
N$134  (via drill 1 pad 1.93)
  other vias: 50.55,11.68
N$135  (via drill 1 pad 1.93)
  other vias: 50.55,9.14
N$136  (via drill 1 pad 1.93)
  other vias: 50.55,6.6
N$137  (via drill 1 pad 1.93)
  other vias: 50.55,4.06
N$138  (via drill 1 pad 1.93)
  other vias: 50.55,1.52
N$139  (via drill 1 pad 1.93)
  other vias: 53.09,1.52
N$140  (via drill 1 pad 1.93)
  other vias: 53.09,4.06
N$141  (via drill 1 pad 1.93)
  other vias: 53.09,6.6
N$142  (via drill 1 pad 1.93)
  other vias: 53.09,11.68
N$143  (via drill 1 pad 1.93)
  other vias: 55.63,9.14
N$144  (via drill 1 pad 1.93)
  other vias: 53.09,9.14
N$145  (via drill 1 pad 1.93)
  other vias: 55.63,6.6
N$146  (via drill 1 pad 1.93)
  other vias: 55.63,4.06
N$147  (via drill 1 pad 1.93)
  other vias: 55.63,1.52
RXD
  Top 0.305: JP3.4 10.92,48.26 11.43,48.26 12.95,49.78 13.97,49.78 14.73,50.55 14.73,51.82 15.37,52.45 17.14,52.45 18.46,53.77 RPI1.10
  Top 0.406: U2.P$9 11.51,34.08 9.91,35.69 JP3.4
SCL
  Top 0.305: JP3.2 6.6,49.02 11.24,49.02 RPI1.5
SDA
  Top 0.305: JP3.1 2.29,47.75 3.3,48.77 4.83,48.77 5.84,49.78 9.91,49.78 10.91,50.79 RPI1.3
SPI_CE0
  Top 0.305: JP3.16 37.59,50.04 37.59,52.2 36.31,53.48 RPI1.24
SPI_CE1
  Bottom 0.305: RPI1.26 38.85,53.61 40.13,52.32 40.13,50.04 JP3.17
SPI_MISO
  Top 0.305: JP3.14 33.77,48.78 RPI1.21
SPI_MOSI
  Top 0.305: JP3.13 31.23,48.78 RPI1.19
SPI_SCLK
  Top 0.305: JP3.15 36.31,48.78 RPI1.23
TXD
  Top 0.406: U2.P$10 7.37,34.41 JP3.3
  Bottom 0.305: JP3.3 9.65,49.53 11.18,49.53 12.19,50.55 12.19,52.32 12.32,52.45 14.61,52.45 15.92,53.77 RPI1.8
VBACKUP  (via drill 0.8 pad 1.42)
  Top 0.254: B1.+$2 10.19,10.7 13.34,13.84 22.99,13.84 v26.67,10.16
  Top 0.406: 26.54,10.16 26.54,7.38 26.64,7.46 26.64,7.34 B1.+$1 | U2.P$4 19.01,28.48 26.54,20.95 26.54,10.16 | 26.54,10.16 v26.67,10.16
VCC
  Top 0.406: U2.P$1 23.51,33.82 C1.1 C2.1 22.79,38.87 FB1.2

### Text on the board
tPlace: #21 | #20 | SDA | SCL | TXD | RXD | #4 | #17 | #18 | #27 | #22 | #23 | #24 | #25 | MOSI | MISO | CLK | CE0 | CE1 | #5 | #6 | #12 | #13 | #16 | #19 | Ultimate GPS Pi HAT | PPS | Fix | Ext Antenna | +3V | +5V | GND | CR1220